# EAGLE design HP-noninv (EAGLE 7.2.0)
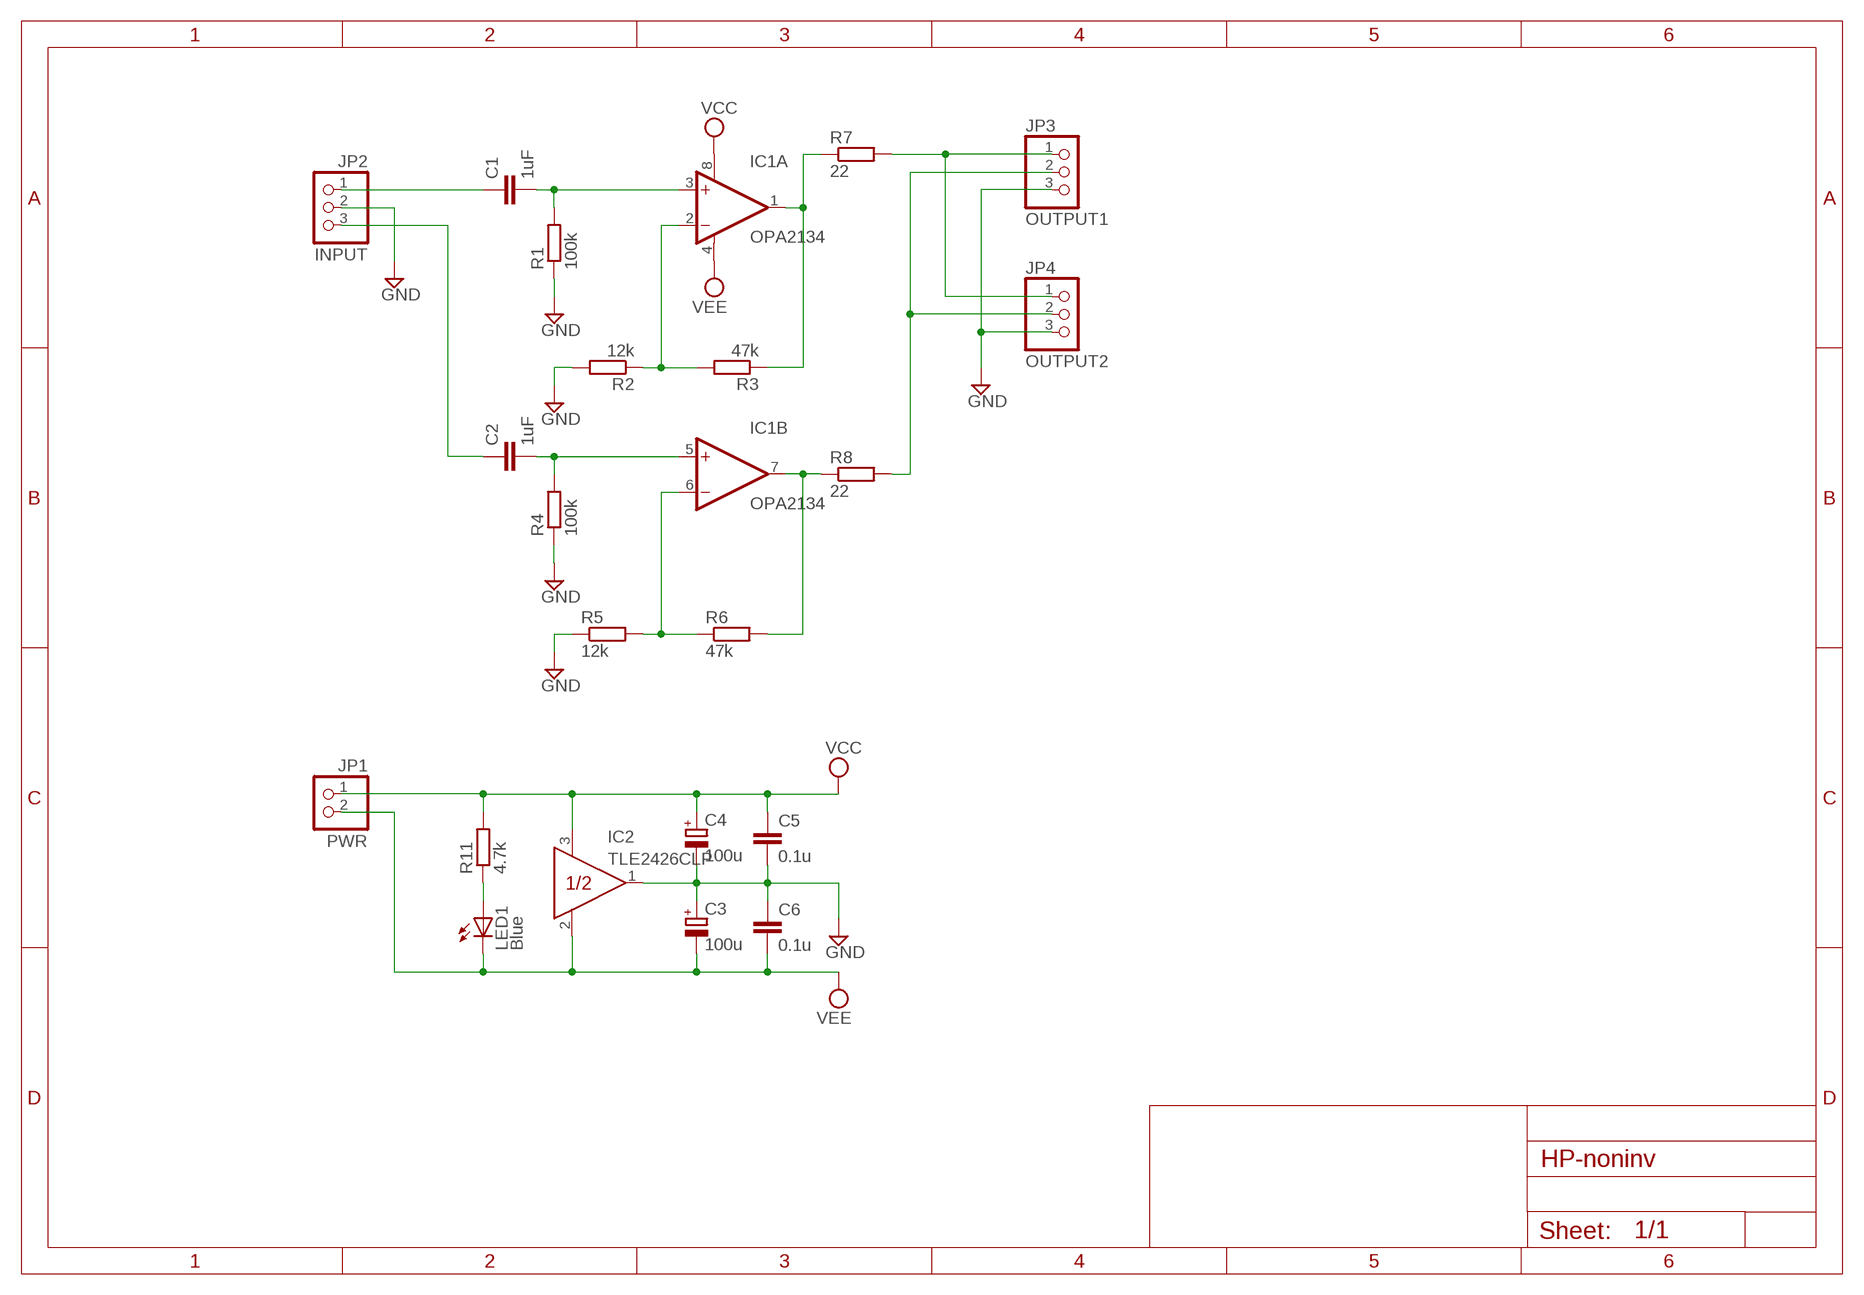
[diagram p0: schematic, sheet 1]

## Parts
C1  1uF  C-EU050-050X075  [C050-050X075]
C2  1uF  C-EU050-050X075  [C050-050X075]
C3  100u  CPOL-EUTT5D6L  [TT5D6L]
C4  100u  CPOL-EUTT5D6L  [TT5D6L]
C5  0.1u  C-EU025-024X044  [C025-024X044]
C6  0.1u  C-EU050-024X044  [C050-024X044]
IC1  OPA2134  OPA2134P  [DIL08]
IC2  TLE2426CLP  [TO226AA]
JP1  PWR  PINHD-1X2  [1X02]
JP2  INPUT  PINHD-1X3  [1X03]
JP3  OUTPUT1  PINHD-1X3  [1X03]
JP4  OUTPUT2  PINHD-1X3  [1X03]
LED1  Blue  LED3MM  [LED3MM]
R1  100k  R-EU_0207/7  [0207/7]
R2  12k  R-EU_0207/7  [0207/7]
R3  47k  R-EU_0207/7  [0207/7]
R4  100k  R-EU_0207/7  [0207/7]
R5  12k  R-EU_0207/7  [0207/7]
R6  47k  R-EU_0207/7  [0207/7]
R7  22  R-EU_0207/7  [0207/7]
R8  22  R-EU_0207/7  [0207/7]
R11  4.7k  R-EU_0207/7  [0207/7]

## Nets
GND: C3.+ C4.- C5.2 C6.1 IC2.1(OUT) JP2.2 JP3.3 JP4.3 R1.1 R2.2 R4.1 R5.1
N$1: C1.1 JP2.1
N$2: IC1.1(A:OUT) R3.1 R7.1
N$3: C2.1 JP2.3
N$4: IC1.7(B:OUT) R6.2 R8.1
N$5: C2.2 IC1.5(B:+IN) R4.2
N$6: C1.2 IC1.3(A:+IN) R1.2
N$7: IC1.2(A:-IN) R2.1 R3.2
N$8: JP3.1 JP4.1 R7.2
N$9: IC1.6(B:-IN) R5.2 R6.1
N$11: JP3.2 JP4.2 R8.2
N$13: LED1.A R11.1
VCC: C4.+ C5.1 IC1.8(A:V+) IC2.3(IN) JP1.1 R11.2
VEE: C3.- C6.2 IC1.4(A:V-) IC2.2(COM) JP1.2 LED1.K(C)

## Library data of the parts
C1 C2 C5 C6 = rcl:C-EU: CAPACITOR, European symbol
C3 C4 = rcl:CPOL-EU: POLARIZED CAPACITOR, European symbol
IC1 = burr-brown:OPA2134: Operational Amplifier; MF: TEXAS INSTRUMENTS; MPN: OPA2134PA; OC_FARNELL: 1097574; OC_NEWARK: 74K3897
IC2 = tle2426:TLE2426*L: Texas Instruments "rail splitter". No noise-reduction pin.
JP1 = pinhead:PINHD-1X2: PIN HEADER
JP2-JP4 = pinhead:PINHD-1X3: PIN HEADER
LED1 = led:LED: LED OSRAM: - CHIPLED LG R971, LG N971, LY N971, LG Q971, LY Q971, LO R971, LY R971 LH N974, LH R974 LS Q976, LO Q976, LY Q976 LO Q996 - Hyper CHIPLED LW Q18S LB Q993, LB Q99A, LB R99A - SideLED LS A670, LO A670, LY A670, LG A670, LP A670 LB A673, LV A673, LT A673, LW A673 LH A674 LY A675 LS A676, LA A676, LO A676, LY A676, LW A676 LS A679, LY A679, LG A679 - Hyper Micro SIDELED® LS Y876, LA Y876, LO Y876, LY Y876 LT Y87S - SmartLED LW L88C, LW L88S LB L89C, LB L89S, LG L890 LS L89K, LO L89K, LY L89K LS L896, LA L896, LO L896, LY L896 - TOPLED LS T670, LO T670, LY T670, LG T670, LP T670 LSG T670, LSP T670, LSY T670, LOP T670, LYG T670 LG T671, LOG T671, LSG T671 LB T673, LV T673, LT T673, LW T673 LH T674 LS T676, LA T676, LO T676, LY T676, LB T676, LH T676, LSB T676, LW T676 LB T67C, LV T67C, LT T67C, LS T67K, LO T67K, LY T67K, LW E67C LS E67B, LA E67B, LO E67B, LY E67B, LB E67C, LV E67C, LT E67C LW T67C LS T679, LY T679, LG T679 LS T770, LO T770, LY T770, LG T770, LP T770 LB T773, LV T773, LT T773, LW T773 LH T774 LS E675, LA E675, LY E675, LS T675 LS T776, LA T776, LO T776, LY T776, LB T776 LHGB T686 LT T68C, LB T68C - Hyper Mini TOPLED® LB M676 - Mini TOPLED Santana® LG M470 LS M47K, LO M47K, LY M47K Source: http://www.osram.convergy.de LUXEON: - LUMILED® LXK2-PW12-R00, LXK2-PW12-S00, LXK2-PW14-U00, LXK2-PW14-V00 LXK2-PM12-R00, LXK2-PM12-S00, LXK2-PM14-U00 LXK2-PE12-Q00, LXK2-PE12-R00, LXK2-PE12-S00, LXK2-PE14-T00, LXK2-PE14-U00 LXK2-PB12-K00, LXK2-PB12-L00, LXK2-PB12-M00, LXK2-PB14-N00, LXK2-PB14-P00, LXK2-PB14-Q00 LXK2-PR12-L00, LXK2-PR12-M00, LXK2-PR14-Q00, LXK2-PR14-R00 LXK2-PD12-Q00, LXK2-PD12-R00, LXK2-PD12-S00 LXK2-PH12-R00, LXK2-PH12-S00 LXK2-PL12-P00, LXK2-PL12-Q00, LXK2-PL12-R00 Source: www.luxeon.com KINGBRIGHT: KA-3528ASYC Source: www.kingbright.com
R1-R8 R11 = rcl:R-EU_: RESISTOR, European symbol

## Board
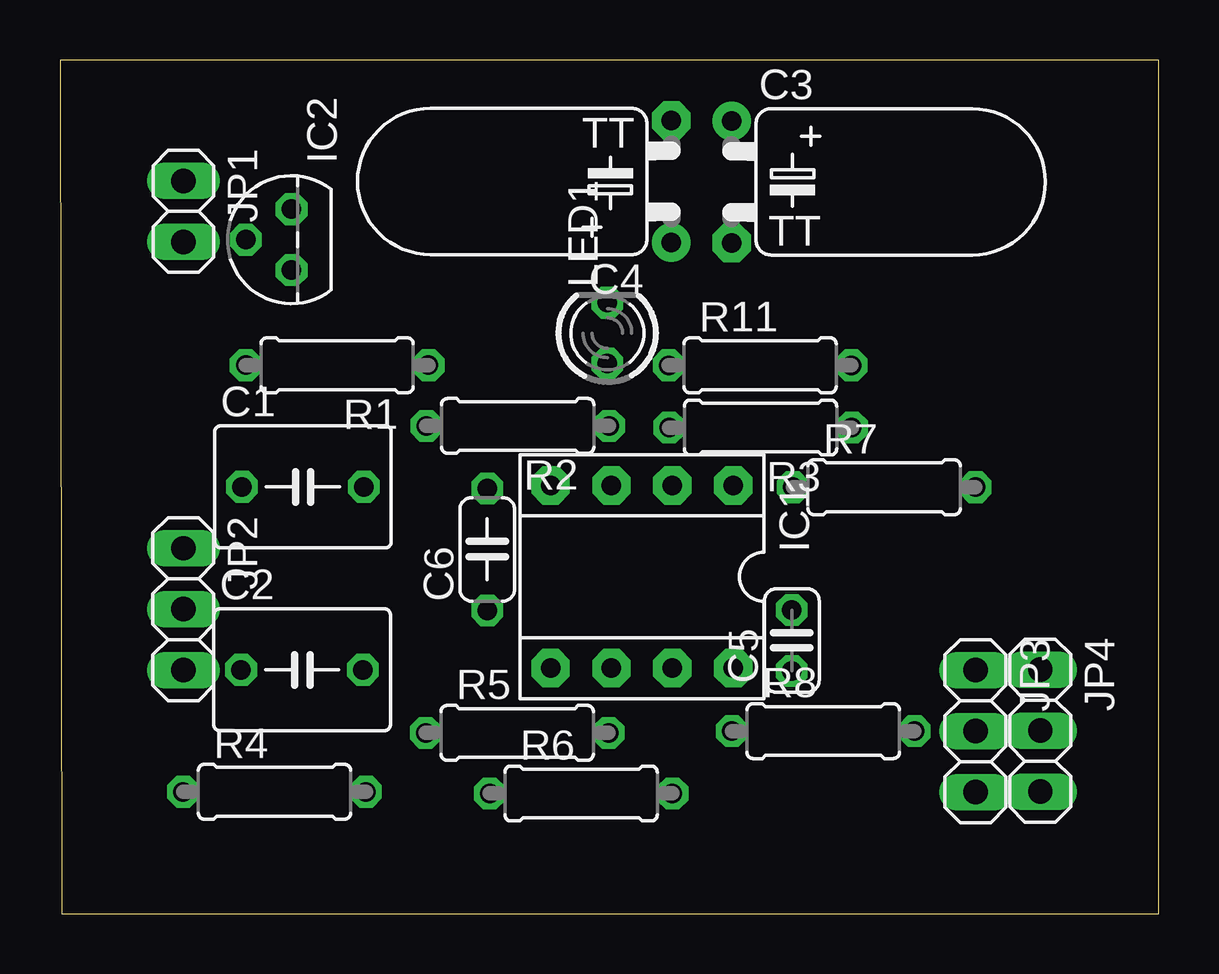
[diagram p1: board, top side]
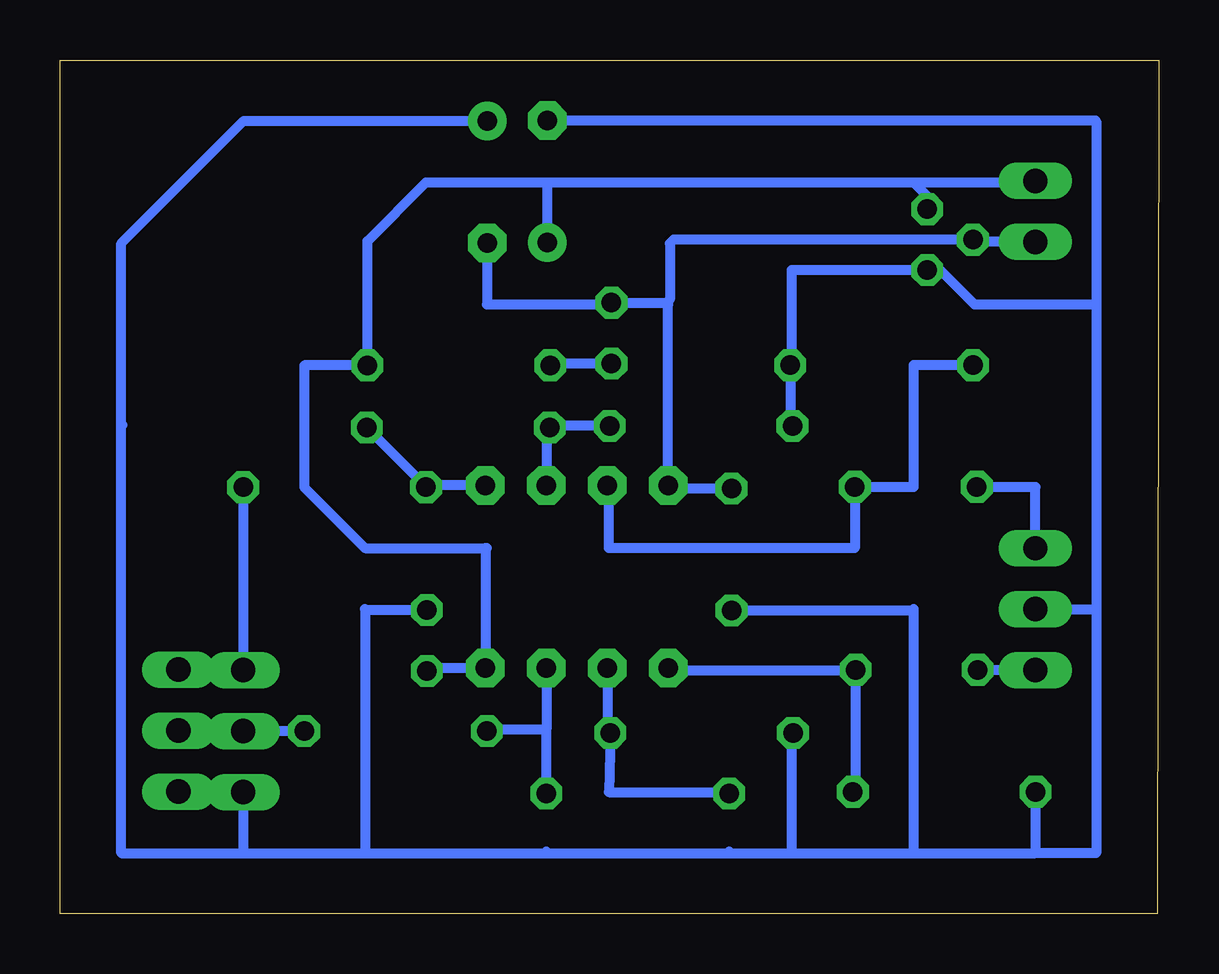
[diagram p2: board, bottom side, seen from below]

Size 45.8 x 35.58 mm. Coordinates in mm from the lower left corner, seen from the top.
Outline: 0.06,0 45.8,0.02 45.79,35.58 0,35.58 0.06,0
Copper layers (1*16): Top 0.035mm / dielectric 1.5mm / Bottom 0.035mm
Design rules "default": minimum track width 10mil, minimum drill 24mil, track to track 8mil, track to pad 8mil, pad to pad 8mil, via to via 8mil, smd to smd 8mil, copper to edge 40mil, drill to drill 8mil, minimum pad ring 10mil, minimum via ring 8mil, stop-mask expansion 4mil, vias tented up to drill 0mil, thermal gap 10mil

### Footprints (pad centres in the part's own frame; a part is rotated, then mirrored left to right if it is on the bottom)
C050-050X075 = drill 0.813 octagon: 1 -2.54,0; 2 2.54,0
TT5D6L = drill 0.813 pad 1.6: + -2.54,0 | drill 0.813 pad 1.6 octagon: - 2.54,0
C025-024X044 = drill 0.813 octagon: 1 -1.27,0; 2 1.27,0
C050-024X044 = drill 0.813 octagon: 1 -2.54,0; 2 2.54,0
DIL08 = drill 0.813 pad 1.6 octagon: 1 -3.81,-3.81; 2 -1.27,-3.81; 3 1.27,-3.81; 4 3.81,-3.81; 5 3.81,3.81; 6 1.27,3.81; 7 -1.27,3.81; 8 -3.81,3.81
TO226AA = drill 0.813 octagon: 1 -1.27,0; 2 0,1.905; 3 1.27,0
1X02 = drill 1.016 long: 1 -1.27,0; 2 1.27,0
1X03 = drill 1.016 long: 1 -2.54,0; 2 0,0; 3 2.54,0
LED3MM = drill 0.813 octagon: A -1.27,0; K 1.27,0
0207/7 = drill 0.813 octagon: 1 -3.81,0; 2 3.81,0

### Placement (x,y rotation side)
C1  10.13,17.8 0 top
C2  10.09,10.17 0 top
C3  27.99,30.5 270 top
C4  25.48,30.52 90 top
C5  30.5,11.39 90 top
C6  17.81,15.19 90 top
IC1  24.26,14.05 180 top
IC2  9.65,28.1 90 top
JP1  5.15,29.27 270 top
JP2  5.14,12.7 270 top
JP3  38.16,7.62 270 top
JP4  40.86,7.64 270 top
LED1  22.82,24.2 90 top
R1  11.55,22.86 180 top
R2  19.08,20.34 180 top
R3  29.2,20.27 180 top
R4  8.94,5.09 0 top
R5  19.06,7.54 0 top
R6  21.72,5.02 0 top
R7  34.35,17.78 0 top
R8  31.81,7.62 0 top
R11  29.18,22.86 0 top

### Tracks (layer width: path | path; a pad name or v marks a point on that pad's centre or on a via)
GND
  Bottom 0.406: 25.46,2.54 17.84,2.54 | 17.84,2.54 15.3,2.54 | 15.3,2.54 10.22,2.54 | 10.22,2.54 5.14,2.54 | C6.1 10.22,12.65 | 10.22,12.65 10.22,12.7 | 10.22,12.65 10.22,2.54 | R4.1 5.14,2.54 | JP2.2 2.6,12.7 | 2.6,12.7 2.6,2.54 5.14,2.54 | 38.16,2.54 43.24,2.54 43.24,20.32 | 38.16,2.54 33.08,2.54 | 33.08,2.54 25.46,2.54 | 25.53,2.6 25.46,2.54 | 43.24,20.32 43.24,27.94 38.14,33.04 C3.+ | 43.19,20.37 43.24,20.32 | 17.91,2.61 17.84,2.54 | 2.6,25.4 2.6,33.02 2.65,33.06 C4.- | 2.6,25.4 2.6,12.7 | 2.6,25.4 7.68,25.4 9.11,26.83 IC2.1 15.3,26.83 15.3,22.92 R1.1 15.36,20.43 R2.2 | 38.16,2.54 JP3.3 40.86,5.08 JP4.3 | R5.1 15.3,7.54 15.3,2.54 | C5.2 33.05,12.66 33.08,12.7 33.08,2.54
N$1
  Bottom 0.406: JP2.1 5.14,17.78 7.59,17.78 C1.1
N$2
  Bottom 0.406: IC1.1 30.54,17.86 | 30.54,17.86 R7.1 | 32.96,20.32 R3.1 30.6,17.86 30.54,17.86
N$3
  Bottom 0.406: JP2.3 7.54,10.16 C2.1
N$4
  Bottom 0.406: R8.1 27.94,7.69 25.53,7.69 | IC1.7 25.53,7.69 | R6.2 25.53,7.69
N$5
  Bottom 0.406: IC1.5 20.38,10.24 20.38,10.16 C2.2 12.63,5.09 R4.2
N$6
  Bottom 0.406: IC1.3 22.92,17.86 22.92,15.24 12.67,15.24 C1.2 12.67,17.78 10.22,17.78 10.22,22.86 R1.2
N$7
  Bottom 0.406: 25.5,17.89 IC1.2 25.53,20.32 25.46,20.32 25.46,20.3 25.43,20.3 R3.2 25.32,20.34 R2.1
N$8
  Bottom 0.406: R7.2 JP3.1 40.86,10.16 JP4.1
N$9
  Bottom 0.406: R6.1 17.84,5.02 | 17.84,5.08 17.85,5.08 R6.1 | IC1.6 22.99,7.67 R5.2 22.85,7.54 22.92,5.08 17.97,5.08 R6.1
N$11
  Bottom 0.406: R8.2 JP3.2 40.86,7.62 JP4.2
N$13
  Bottom 0.406: LED1.A 25.3,22.93 R11.1
VCC
  Bottom 0.406: 25.46,30.48 30.54,30.48 32.99,28.04 R11.2 35.62,22.86 35.62,17.78 33.08,15.24 28.07,15.24 | 25.46,30.48 10.22,30.48 | 10.22,30.48 5.21,30.48 JP1.1 | IC2.3 9.65,29.91 10.22,30.48 | C4.+ 25.48,30.46 25.46,30.48 | C5.1 30.51,10.24 IC1.8 28.07,15.24 | 28,15.24 28.07,15.24
VEE
  Bottom 0.406: C6.2 20.45,17.73 IC1.4 20.45,25.4 20.52,25.47 | 20.52,25.47 LED1.K 22.89,25.4 28,25.4 28,25.41 C3.- | JP1.2 7.62,28 7.68,27.94 7.68,28.03 IC2.2 20.23,28.1 20.38,27.94 20.38,25.61 20.52,25.47